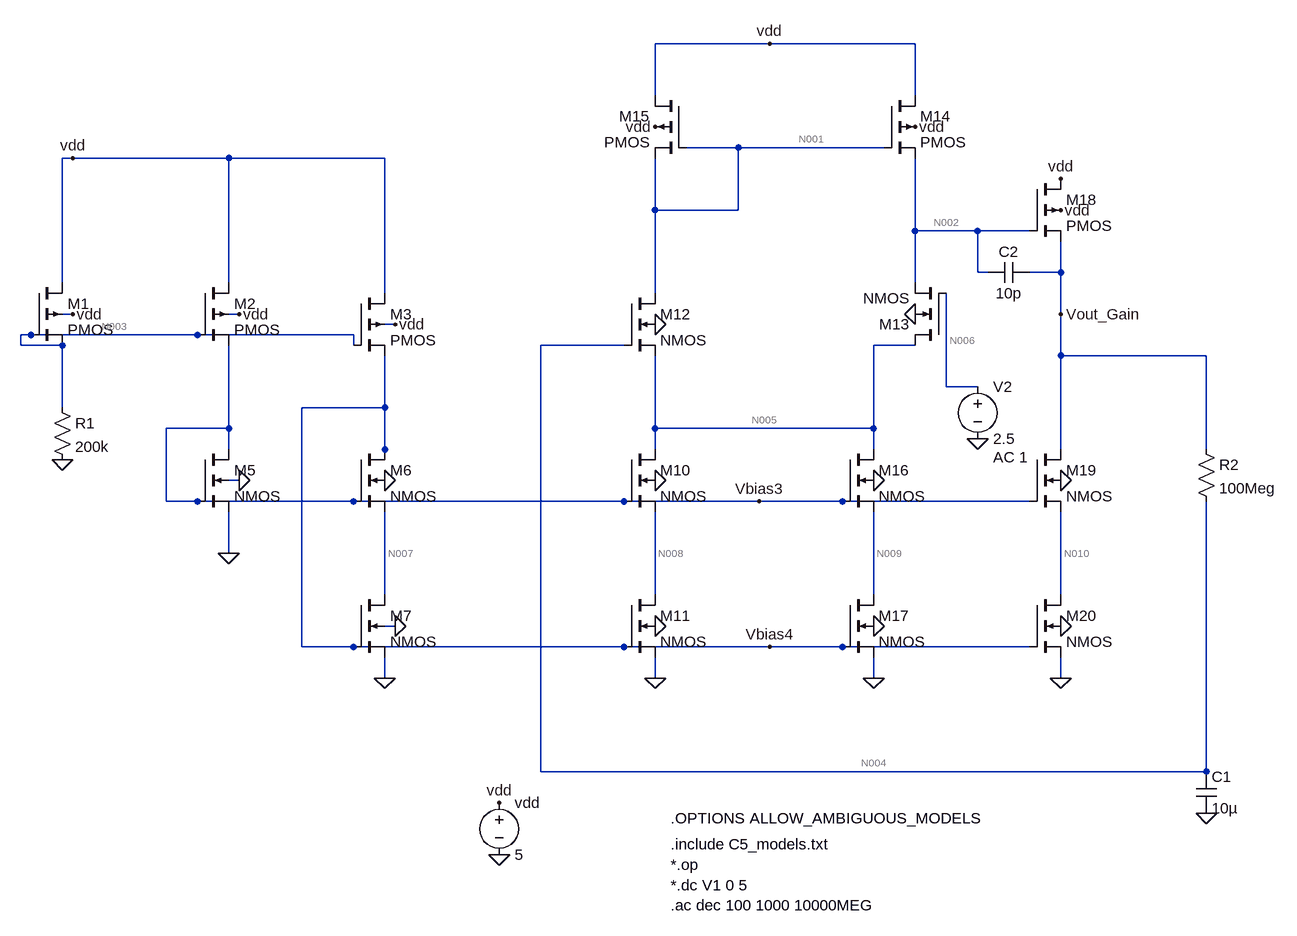
[diagram p0: schematic final_text.asc]
final_text.asc, the LTspice schematic file:
Version 4.1
SHEET 1 1924 1124
WIRE 1136 -208 960 -208
WIRE 1360 -208 1136 -208
WIRE 960 -128 960 -208
WIRE 1360 -128 1360 -208
WIRE 1088 -48 1008 -48
WIRE 1312 -48 1088 -48
WIRE 64 -32 48 -32
WIRE 304 -32 64 -32
WIRE 544 -32 304 -32
WIRE 960 48 960 -32
WIRE 1088 48 1088 -48
WIRE 1088 48 960 48
WIRE 1360 80 1360 -32
WIRE 1456 80 1360 80
WIRE 1536 80 1456 80
WIRE 1456 144 1456 80
WIRE 1472 144 1456 144
WIRE 1584 144 1584 96
WIRE 1584 144 1536 144
WIRE 48 160 48 -32
WIRE 304 160 304 -32
WIRE 1360 160 1360 80
WIRE 544 176 544 -32
WIRE 960 176 960 48
WIRE 64 208 48 208
WIRE 320 208 304 208
WIRE 1584 208 1584 144
WIRE 560 224 544 224
WIRE 0 240 -16 240
WIRE 256 240 0 240
WIRE 496 240 256 240
WIRE -16 256 -16 240
WIRE 48 256 -16 256
WIRE 496 256 496 240
WIRE 912 256 784 256
WIRE 1360 256 1296 256
WIRE 1584 272 1584 208
WIRE 1808 272 1584 272
WIRE 1408 320 1408 176
WIRE 1456 320 1408 320
WIRE 48 352 48 256
WIRE 544 352 544 272
WIRE 544 352 416 352
WIRE 304 384 304 256
WIRE 304 384 208 384
WIRE 960 384 960 272
WIRE 1296 384 1296 256
WIRE 1296 384 960 384
WIRE 304 416 304 384
WIRE 544 416 544 352
WIRE 960 416 960 384
WIRE 1296 416 1296 384
WIRE 1584 416 1584 272
WIRE 1808 416 1808 272
WIRE 544 432 544 416
WIRE 320 464 304 464
WIRE 208 496 208 384
WIRE 256 496 208 496
WIRE 496 496 256 496
WIRE 912 496 496 496
WIRE 1120 496 912 496
WIRE 1248 496 1120 496
WIRE 1536 496 1248 496
WIRE 304 576 304 512
WIRE 544 640 544 512
WIRE 960 640 960 512
WIRE 1296 640 1296 512
WIRE 1584 640 1584 512
WIRE 560 688 544 688
WIRE 416 720 416 352
WIRE 496 720 416 720
WIRE 912 720 496 720
WIRE 1136 720 912 720
WIRE 1248 720 1136 720
WIRE 1536 720 1248 720
WIRE 544 768 544 736
WIRE 960 768 960 736
WIRE 1296 768 1296 736
WIRE 1584 768 1584 736
WIRE 784 912 784 256
WIRE 1808 912 1808 496
WIRE 1808 912 784 912
FLAG 48 432 0
FLAG 64 208 vdd
FLAG 320 208 vdd
FLAG 560 224 vdd
FLAG 320 464 0
FLAG 544 464 0
FLAG 304 576 0
FLAG 544 768 0
FLAG 560 688 0
FLAG 960 464 0
FLAG 960 688 0
FLAG 960 224 0
FLAG 960 768 0
FLAG 1296 768 0
FLAG 1584 768 0
FLAG 1296 688 0
FLAG 1584 688 0
FLAG 1296 464 0
FLAG 1584 464 0
FLAG 1360 208 0
FLAG 1456 400 0
FLAG 960 -80 vdd
FLAG 1360 -80 vdd
FLAG 1584 48 vdd
FLAG 1584 0 vdd
FLAG 1808 976 0
FLAG 720 1040 0
FLAG 720 960 vdd
FLAG 64 -32 vdd
FLAG 1136 -208 vdd
FLAG 1120 496 Vbias3
FLAG 1136 720 Vbias4
FLAG 1584 208 Vout_Gain
SYMBOL res 32 336 R0
SYMATTR InstName R1
SYMATTR Value 200k
SYMBOL pmos4 0 160 R0
SYMATTR InstName M1
SYMATTR Value2 l=0.6u w=6.6u
SYMBOL pmos4 256 160 R0
SYMATTR InstName M2
SYMATTR Value2 l=0.6u w=6.6u
SYMBOL pmos4 496 176 R0
SYMATTR InstName M3
SYMATTR Value2 l=0.6u w=6.6u
SYMBOL nmos4 256 416 R0
SYMATTR InstName M5
SYMATTR Value2 l=6.6u w=3u
SYMBOL nmos4 496 416 R0
SYMATTR InstName M6
SYMATTR Value2 l=0.6u w=3u
SYMBOL nmos4 496 640 R0
SYMATTR InstName M7
SYMATTR Value2 l=0.6u w=3u
SYMBOL nmos4 912 416 R0
SYMATTR InstName M10
SYMATTR Value2 l=0.6u w=3u
SYMBOL nmos4 912 640 R0
SYMATTR InstName M11
SYMATTR Value2 l=0.6u w=3u
SYMBOL nmos4 912 176 R0
SYMATTR InstName M12
SYMATTR Value2 l=0.6u w=3u
SYMBOL nmos4 1408 256 R180
SYMATTR InstName M13
SYMATTR Value2 l=0.6u w=3u
SYMBOL nmos4 1248 416 R0
SYMATTR InstName M16
SYMATTR Value2 l=0.6u w=3u
SYMBOL nmos4 1248 640 R0
SYMATTR InstName M17
SYMATTR Value2 l=0.6u w=3u
SYMBOL nmos4 1536 416 R0
SYMATTR InstName M19
SYMATTR Value2 l=0.6u w=30u
SYMBOL nmos4 1536 640 R0
SYMATTR InstName M20
SYMATTR Value2 l=0.6u w=30u
SYMBOL voltage 1456 304 R0
WINDOW 123 24 124 Left 2
WINDOW 39 0 0 Left 0
SYMATTR Value2 AC 1
SYMATTR InstName V2
SYMATTR Value 2.5
SYMBOL pmos4 1312 -128 R0
SYMATTR InstName M14
SYMATTR Value2 l=0.6u w=6.6u
SYMBOL pmos4 1008 -128 M0
SYMATTR InstName M15
SYMATTR Value2 l=0.6u w=6.6u
SYMBOL pmos4 1536 0 R0
SYMATTR InstName M18
SYMATTR Value2 l=0.6u w=66u
SYMBOL cap 1792 912 R0
SYMATTR InstName C1
SYMATTR Value 10µ
SYMBOL cap 1472 128 M90
WINDOW 0 0 32 VBottom 2
WINDOW 3 32 32 VTop 2
SYMATTR InstName C2
SYMATTR Value 10p
SYMBOL res 1792 400 R0
SYMATTR InstName R2
SYMATTR Value 100Meg
SYMBOL voltage 720 944 R0
SYMATTR InstName vdd
SYMATTR Value 5
TEXT 984 1024 Left 2 !.include C5_models.txt\n*.op\n*.dc V1 0 5\n.ac dec 100 1000 10000MEG
TEXT 984 984 Left 2 !.OPTIONS ALLOW_AMBIGUOUS_MODELS

The netlist it stands for:
* final_text.asc
R1 N003 0 200k
M1 vdd N003 N003 vdd PMOS l=0.6u w=6.6u
M2 vdd N003 Vbias3 vdd PMOS l=0.6u w=6.6u
M3 vdd N003 Vbias4 vdd PMOS l=0.6u w=6.6u
M5 Vbias3 Vbias3 0 0 NMOS l=6.6u w=3u
M6 Vbias4 Vbias3 N007 0 NMOS l=0.6u w=3u
M7 N007 Vbias4 0 0 NMOS l=0.6u w=3u
M10 N005 Vbias3 N008 0 NMOS l=0.6u w=3u
M11 N008 Vbias4 0 0 NMOS l=0.6u w=3u
M12 N001 N004 N005 0 NMOS l=0.6u w=3u
M13 N005 N006 N002 0 NMOS l=0.6u w=3u
M16 N005 Vbias3 N009 0 NMOS l=0.6u w=3u
M17 N009 Vbias4 0 0 NMOS l=0.6u w=3u
M19 Vout_Gain Vbias3 N010 0 NMOS l=0.6u w=30u
M20 N010 Vbias4 0 0 NMOS l=0.6u w=30u
V2 N006 0 2.5 AC 1
M14 vdd N001 N002 vdd PMOS l=0.6u w=6.6u
M15 vdd N001 N001 vdd PMOS l=0.6u w=6.6u
M18 vdd N002 Vout_Gain vdd PMOS l=0.6u w=66u
C1 N004 0 10µ
C2 N002 Vout_Gain 10p
R2 Vout_Gain N004 100Meg
vdd vdd 0 5
.model NMOS NMOS
.model PMOS PMOS
.lib standard.mos
.include C5_models.txt
*.op
*.dc V1 0 5
.ac dec 100 1000 10000MEG
.OPTIONS ALLOW_AMBIGUOUS_MODELS
.backanno
.end

* Results of the author's LTspice run, read from the files saved beside the schematic
* Operating Point, zero values left out:
*   V(vdd) = 5 V
*   V(vbias4) = 688.7 mV
*   V(n007) = 548.2 mV
*   V(n008) = 1.427 V
*   V(n006) = 2.5 V
*   V(n009) = 1.427 V
*   V(vout_gain) = 2.5 V
*   V(n003) = 4.545 V
*   V(vbias3) = 2.236 V
*   V(n005) = 1.811 V
*   V(n001) = 4.536 V
*   V(n004) = 2.5 V
*   V(n002) = 4.536 V
*   V(n010) = 1.547 V
*   Id(M5) = 22.73 µA
*   Is(M5) = -22.73 µA
*   Ib(M5) = -2.246 pA
*   Id(M6) = 22.73 µA
*   Is(M6) = -22.73 µA
*   Ib(M6) = -1.257 pA
*   Id(M10) = 23.71 µA
*   Is(M10) = -23.71 µA
*   Ib(M10) = -3.258 pA
*   Id(M13) = -23.71 µA
*   Is(M13) = 23.71 µA
*   Ib(M13) = -6.367 pA
*   Id(M17) = 23.71 µA
*   Is(M17) = -23.71 µA
*   Ib(M17) = -1.437 pA
*   Id(M18) = 237.1 µA
*   Is(M18) = -237.1 µA
*   Ib(M18) = 2.51 pA
*   I(R1) = 22.73 µA
*   Id(M2) = 22.73 µA
*   Is(M2) = -22.73 µA
*   Ib(M2) = 2.774 pA
*   Id(M19) = 237.1 µA
*   Is(M19) = -237.1 µA
*   Ib(M19) = -4.067 pA
*   Id(M1) = 22.73 µA
*   Is(M1) = -22.73 µA
*   Id(M7) = 22.73 µA
*   Is(M7) = -22.73 µA
*   Id(M11) = 23.71 µA
*   Is(M11) = -23.71 µA
*   Ib(M11) = -1.437 pA
*   Id(M20) = 237.1 µA
*   Is(M20) = -237.1 µA
*   Ib(M20) = -1.557 pA
*   Id(M15) = 23.71 µA
*   Is(M15) = -23.71 µA
*   I(vdd) = -352.8 µA
*   Id(M3) = 22.73 µA
*   Is(M3) = -22.73 µA
*   Ib(M3) = 4.321 pA
*   Id(M12) = 23.71 µA
*   Is(M12) = -23.71 µA
*   Ib(M12) = -6.367 pA
*   Id(M16) = 23.71 µA
*   Is(M16) = -23.71 µA
*   Ib(M16) = -3.258 pA
*   Id(M14) = 23.71 µA
*   Is(M14) = -23.71 µA
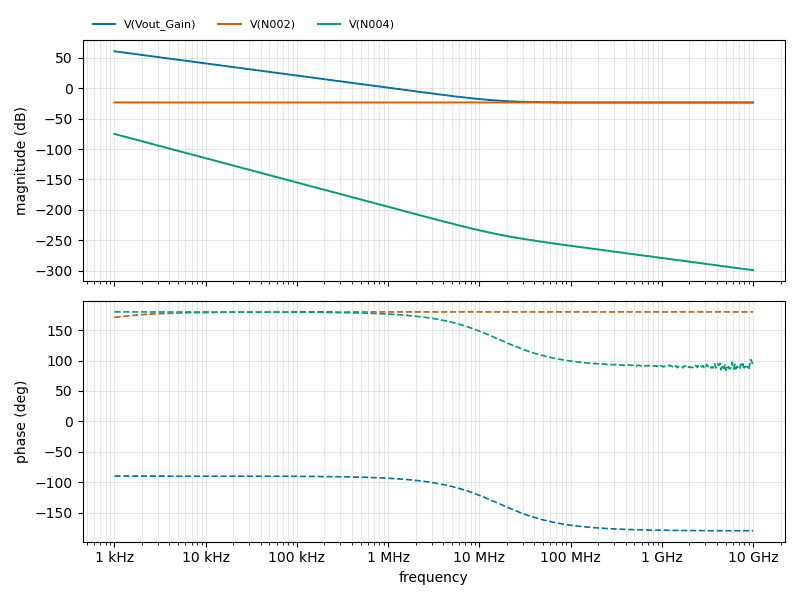
[diagram p1: AC Analysis of final_text.asc, plotted from the saved traces]
* AC Analysis, 1 run:
*   V(Vout_Gain): 60.80 dB at 1 kHz, -23.42 dB at 10 GHz, peak 60.80 dB at 1 kHz, 3 dB below the peak at 1.414 kHz
*   V(N002): -23.31 dB at 1 kHz, -23.42 dB at 10 GHz, peak -23.31 dB at 1 kHz
*   V(N004): -75.17 dB at 1 kHz, -299.34 dB at 10 GHz, peak -75.17 dB at 1 kHz, 3 dB below the peak at 1.189 kHz